# Altium schematic sheet Conectors.SchDoc
size A4
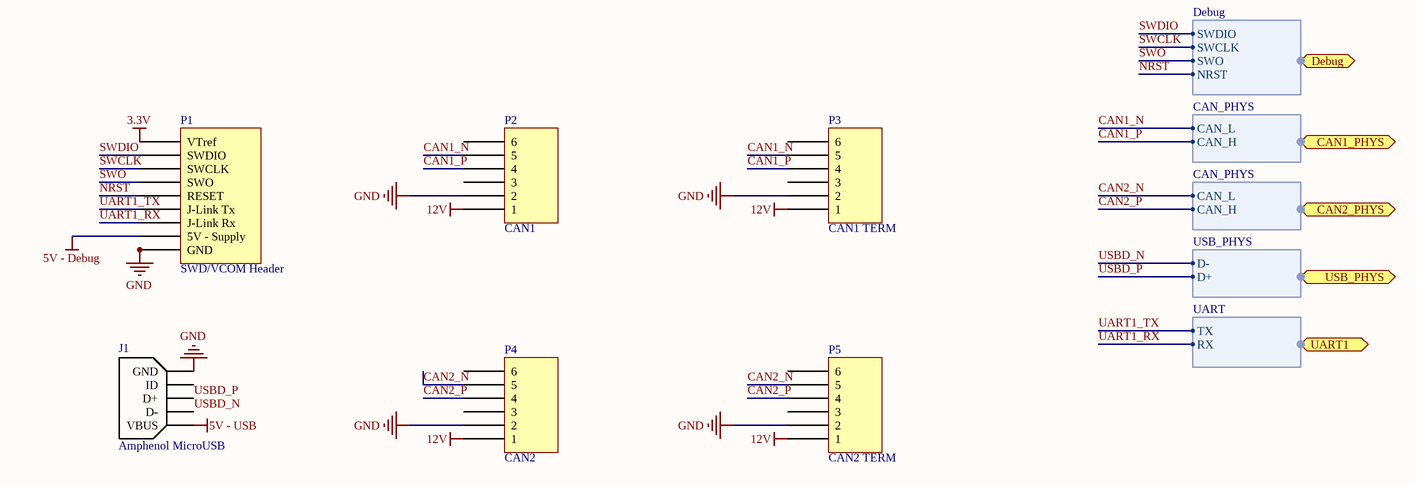
[diagram p0: Conectors.SchDoc]

## Parts
J1  Amphenol MicroUSB  [Amphenol MicroUSB]
P1  SWD/VCOM Header  [Samtec TST-110-01-G-D]
P2  CAN1  [PCB_MLX_MICROFIT_3X2]
P3  CAN1 TERM  [PCB_MLX_MICROFIT_3X2]
P4  CAN2  [PCB_MLX_MICROFIT_3X2]
P5  CAN2 TERM  [PCB_MLX_MICROFIT_3X2]

## Ports
CAN1_PHYS (harness CAN_PHYS), CAN2_PHYS (harness CAN_PHYS), Debug (harness Debug), UART1 (harness UART), USB_PHYS (harness USB_PHYS)

## Harnesses
Debug: SWDIO, SWCLK, SWO, NRST
CAN_PHYS: CAN_L, CAN_H
USB_PHYS: D-, D+
UART: TX, RX

## Nets
3.3V: P1.1(VTref)
5V - Debug: P1.19(5V_-_Supply)
5V - USB: J1.1(VBUS)
12V: P2.1 P3.1 P4.1 P5.1
GND: J1.5(GND) P1.4(GND) P1.6(GND) P1.8(GND) P1.10(GND) P1.12(GND) P2.2 P3.2 P4.2 P5.2
CAN1_N: P2.5 P3.5 ; port CAN1_PHYS.CAN_L
CAN1_P: P2.4 P3.4 ; port CAN1_PHYS.CAN_H
CAN2_N: P4.5 P5.5 ; port CAN2_PHYS.CAN_L
CAN2_P: P4.4 P5.4 ; port CAN2_PHYS.CAN_H
NRST: P1.15(RESET) ; port Debug.NRST
SWCLK: P1.9(SWCLK) ; port Debug.SWCLK
SWDIO: P1.7(SWDIO) ; port Debug.SWDIO
SWO: P1.13(SWO) ; port Debug.SWO
UART1_RX: P1.17(J-Link_Rx) ; port UART1.RX
UART1_TX: P1.5(J-Link_Tx) ; port UART1.TX
USBD_N: J1.2(D-) ; port USB_PHYS.D-
USBD_P: J1.3(D+) ; port USB_PHYS.D+

Not connected (* = marked no-connect by the designer): J1 4(ID); P2 3 6; P3 3 6; P4 3 6; P5 3 6

## Library data of the parts
J1 = Amphenol MicroUSB - 609-4618-1-ND
P2-P5 = SCH_MLX_MICROFIT_3X2